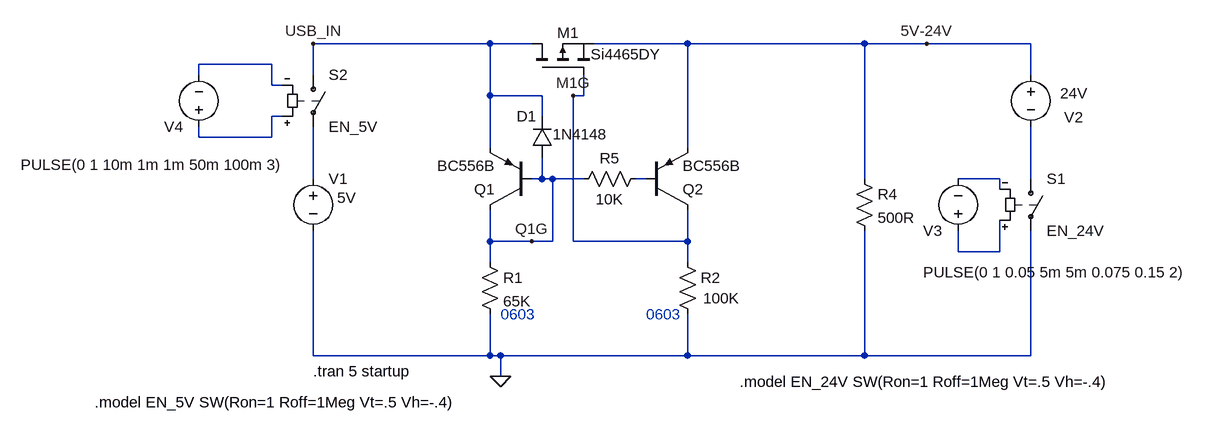
[diagram p0: schematic Simulation_back_powering_zero_voltage_diode.asc]
Simulation_back_powering_zero_voltage_diode.asc, the LTspice schematic file:
Version 4
SHEET 1 1956 680
WIRE 128 96 -144 96
WIRE 192 96 128 96
WIRE 432 96 288 96
WIRE 704 96 432 96
WIRE 800 96 704 96
WIRE 960 96 800 96
WIRE -208 128 -320 128
WIRE -320 144 -320 128
WIRE -144 144 -144 96
WIRE 960 144 960 96
WIRE -208 160 -208 128
WIRE -192 160 -208 160
WIRE 128 176 128 96
WIRE 208 176 128 176
WIRE 272 176 272 144
WIRE 272 176 256 176
WIRE -192 208 -208 208
WIRE 208 208 208 176
WIRE -320 240 -320 224
WIRE -208 240 -208 208
WIRE -208 240 -320 240
WIRE 128 256 128 176
WIRE 432 256 432 96
WIRE -144 304 -144 224
WIRE 208 304 208 272
WIRE 208 304 192 304
WIRE 224 304 208 304
WIRE 272 304 224 304
WIRE 368 304 352 304
WIRE 704 304 704 96
WIRE 912 304 848 304
WIRE 960 304 960 224
WIRE 912 320 912 304
WIRE 128 400 128 352
WIRE 192 400 128 400
WIRE 224 400 224 304
WIRE 224 400 192 400
WIRE 256 400 256 176
WIRE 432 400 432 352
WIRE 432 400 256 400
WIRE 848 416 848 384
WIRE 912 416 912 368
WIRE 912 416 848 416
WIRE 128 432 128 400
WIRE 432 432 432 400
WIRE -144 576 -144 384
WIRE 128 576 128 512
WIRE 128 576 -144 576
WIRE 144 576 128 576
WIRE 432 576 432 512
WIRE 432 576 144 576
WIRE 704 576 704 384
WIRE 704 576 432 576
WIRE 960 576 960 384
WIRE 960 576 704 576
WIRE 144 608 144 576
FLAG 144 608 0
FLAG -144 96 USB_IN
FLAG 800 96 5V-24V
FLAG 256 176 M1G
FLAG 192 400 Q1G
SYMBOL pnp 192 352 R180
SYMATTR InstName Q1
SYMATTR Value BC556B
SYMBOL pnp 368 352 M180
SYMATTR InstName Q2
SYMATTR Value BC556B
SYMBOL res 112 416 R0
SYMATTR InstName R1
SYMATTR Value 65K
SYMBOL res 416 416 R0
WINDOW 3 40 72 Left 2
SYMATTR Value 100K
SYMATTR InstName R2
SYMBOL voltage -144 288 R0
WINDOW 123 0 0 Left 2
WINDOW 39 0 0 Left 2
WINDOW 3 66 45 Right 2
SYMATTR Value 5V
SYMATTR InstName V1
SYMBOL pmos 192 144 R270
WINDOW 3 32 91 VRight 2
WINDOW 0 65 39 VRight 2
SYMATTR Value Si4465DY
SYMATTR InstName M1
SYMBOL voltage 960 128 R0
WINDOW 123 0 0 Left 2
WINDOW 39 0 0 Left 2
WINDOW 3 88 44 Right 2
WINDOW 0 51 81 Left 2
SYMATTR Value 24V
SYMATTR InstName V2
SYMBOL res 688 288 R0
SYMATTR InstName R4
SYMATTR Value 500R
SYMBOL sw 960 288 R0
SYMATTR InstName S1
SYMATTR Value EN_24V
SYMBOL voltage 848 400 R180
WINDOW 123 0 0 Left 2
WINDOW 39 0 0 Left 2
WINDOW 3 54 -48 Right 2
SYMATTR Value PULSE(0 1 0.05 5m 5m 0.075 0.15 2)
SYMATTR InstName V3
SYMBOL sw -144 128 R0
SYMATTR InstName S2
SYMATTR Value EN_5V
SYMBOL voltage -320 240 R180
WINDOW 123 0 0 Left 2
WINDOW 39 0 0 Left 2
WINDOW 3 274 -42 Right 2
SYMATTR Value PULSE(0 1 10m 1m 1m 50m 100m 3)
SYMATTR InstName V4
SYMBOL diode 224 272 R180
WINDOW 0 24 64 Left 2
WINDOW 3 -85 37 Left 2
SYMATTR InstName D1
SYMATTR Value 1N4148
SYMBOL res 368 288 R90
WINDOW 0 0 56 VBottom 2
WINDOW 3 32 56 VTop 2
SYMATTR InstName R5
SYMATTR Value 10K
TEXT -144 600 Left 2 !.tran 5 startup
TEXT 144 512 Left 2 ;0603
TEXT 368 512 Left 2 ;0603
TEXT 512 616 Left 2 !.model EN_24V SW(Ron=1 Roff=1Meg Vt=.5 Vh=-.4)
TEXT -480 648 Left 2 !.model EN_5V SW(Ron=1 Roff=1Meg Vt=.5 Vh=-.4)

The netlist it stands for:
* Simulation_back_powering_zero_voltage_diode.asc
Q1 Q1G Q1G USB_IN 0 BC556B
Q2 M1G N004 5V-24V 0 BC556B
R1 Q1G 0 65K
R2 M1G 0 100K
V1 N003 0 5V
M1 USB_IN M1G 5V-24V 5V-24V Si4465DY
V2 5V-24V N006 24V
R4 5V-24V 0 500R
S1 N006 0 N007 N005 EN_24V
V3 N007 N005 PULSE(0 1 0.05 5m 5m 0.075 0.15 2)
S2 USB_IN N003 N002 N001 EN_5V
V4 N002 N001 PULSE(0 1 10m 1m 1m 50m 100m 3)
D1 Q1G USB_IN 1N4148
R5 N004 Q1G 10K
.model D D
.lib standard.dio
.model NPN NPN
.model PNP PNP
.lib standard.bjt
.model NMOS NMOS
.model PMOS PMOS
.lib standard.mos
.tran 5 startup
* 0603
* 0603
.model EN_24V SW(Ron=1 Roff=1Meg Vt=.5 Vh=-.4)
.model EN_5V SW(Ron=1 Roff=1Meg Vt=.5 Vh=-.4)
.backanno
.end